# EAGLE design display (EAGLE 6.1)
APVD: B.F. (3-janv-2014); DOC_ID: CLK-SCH-01; DOC_PART_NO: CLK-PC-01; DOC_REV: A; DOC_TITLE: LED matrix display board; PROJECT_NAME: Alarm clock

## Sheet 1 of 2
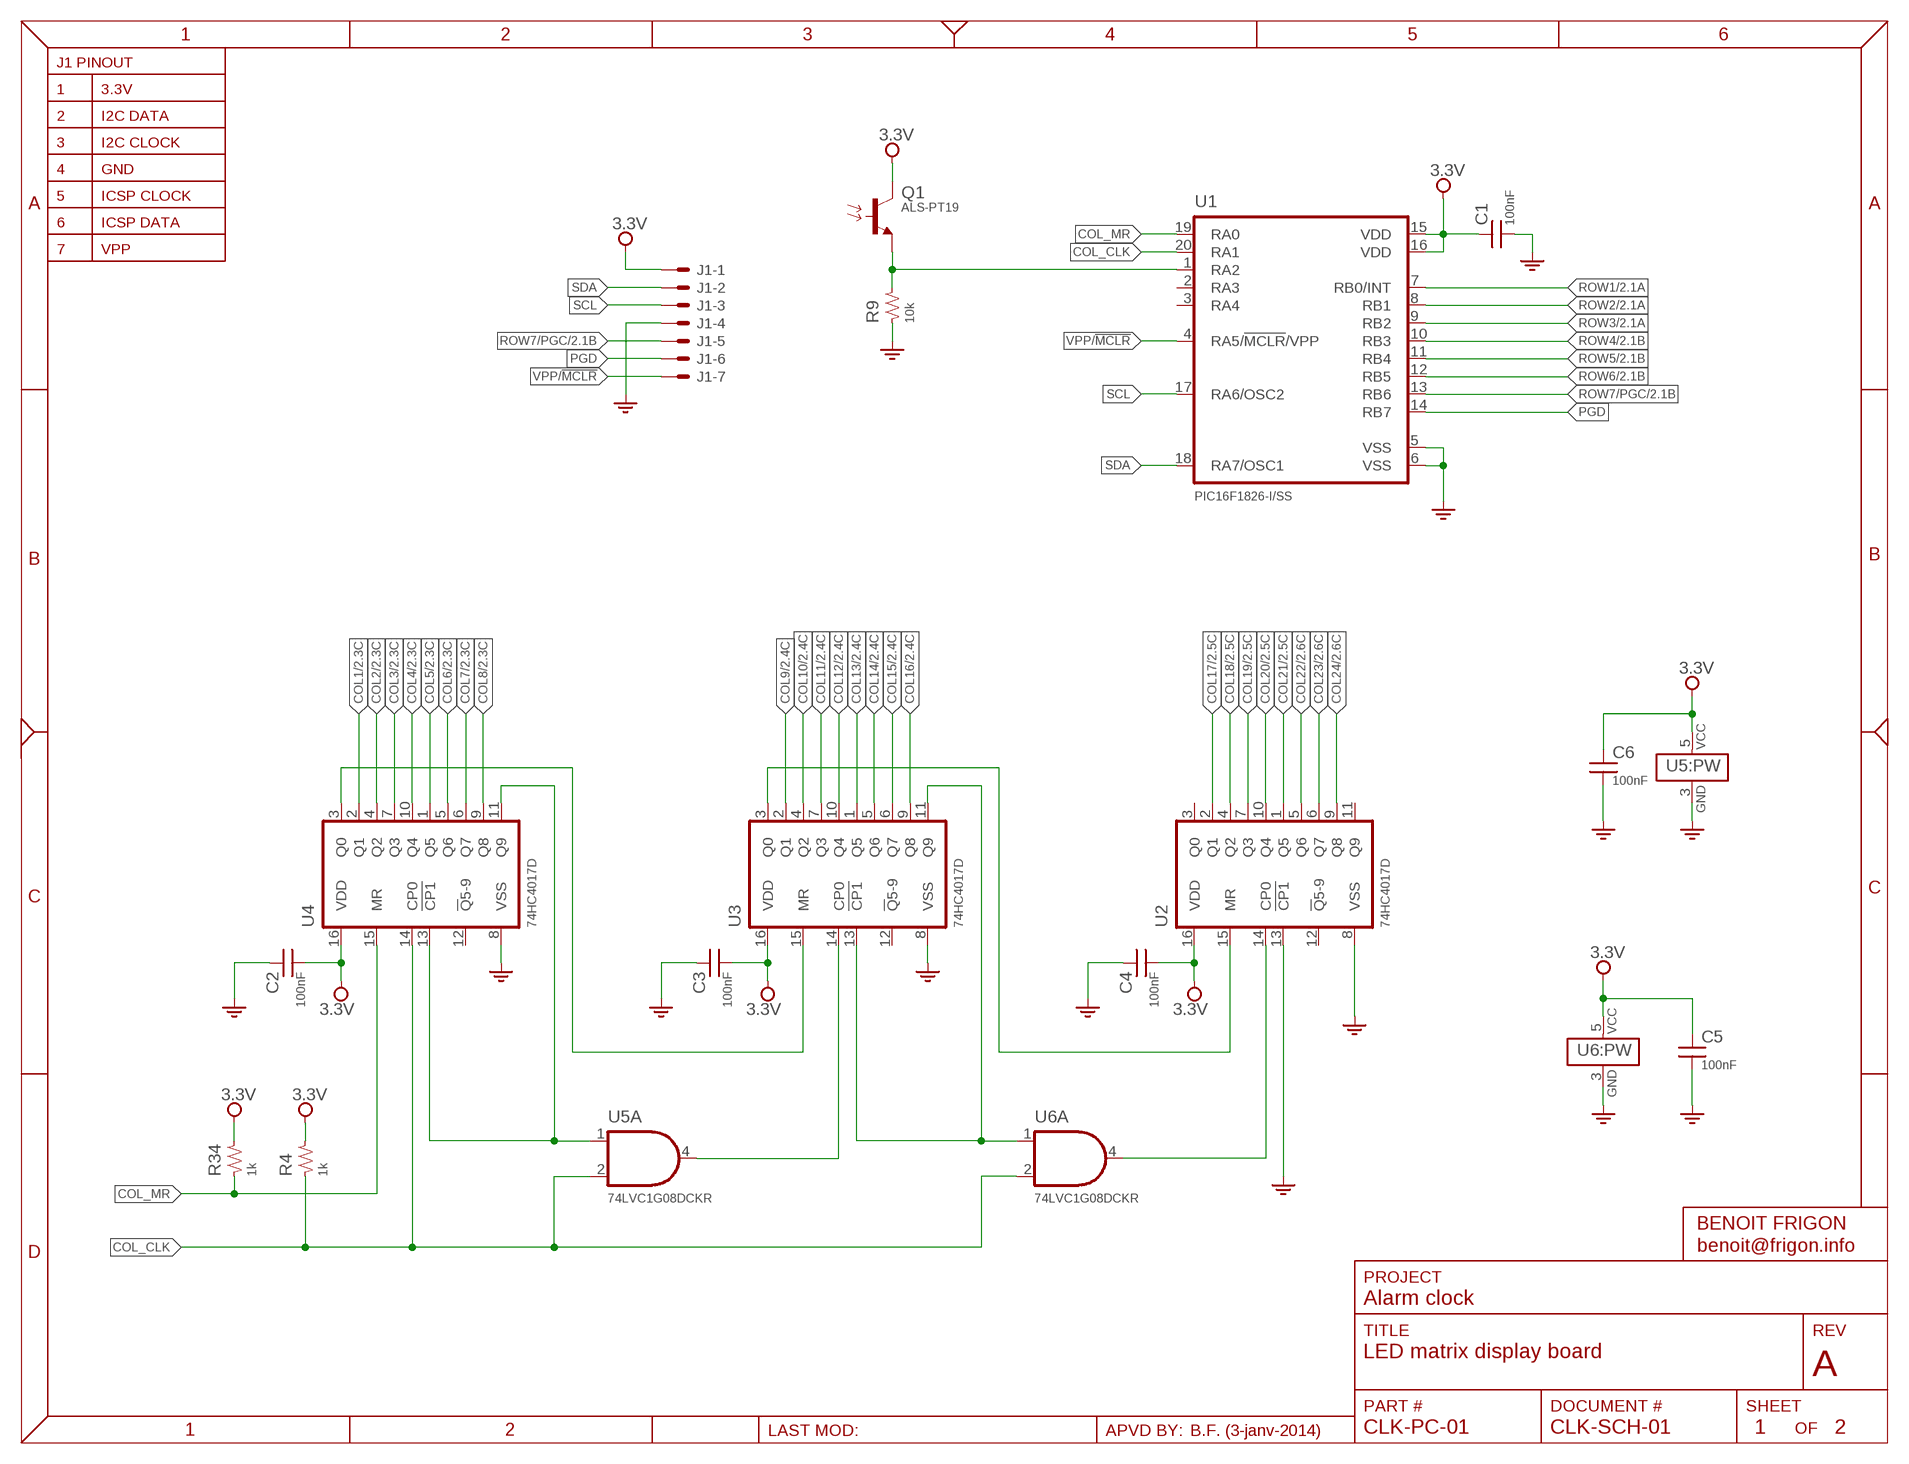
[diagram p0: schematic, sheet 1]

### Parts
C1  100nF  CAP-0603  [SMD_0603]
C2  100nF  CAP-0603  [SMD_0603]
C3  100nF  CAP-0603  [SMD_0603]
C4  100nF  CAP-0603  [SMD_0603]
C5  100nF  CAP-0603  [SMD_0603]
C6  100nF  CAP-0603  [SMD_0603]
J1  SNG-2MM-HEADER-07-V  [DF3X-7P-2DSA]
Q1  ALS-PT19  [ALS-PT19]
R4  1k  RES-0603  [SMD_0603]
R9  10k  RES-0603  [SMD_0603]
R34  1k  RES-0603  [SMD_0603]
U1  PIC16F1826-I/SS  [SSOP20]
U2  74HC4017D  [SOIC16N]
U3  74HC4017D  [SOIC16N]
U4  74HC4017D  [SOIC16N]
U5  74LVC1G08DCKR  [SC70-5]
U6  74LVC1G08DCKR  [SC70-5]

### Nets
3.3V: C1.1 C2.2 C3.2 C4.2 C5.1 C6.1 J1.1 Q1.C R4.2 R34.2 U1.15(VDD) U1.16(VDD) U2.16(VDD) U3.16(VDD) U4.16(VDD) U5.5(:PW:VCC) U6.5(:PW:VCC)
COL1: U4.2(Q1) ; also sheet 2
COL2: U4.4(Q2) ; also sheet 2
COL3: U4.7(Q3) ; also sheet 2
COL4: U4.10(Q4) ; also sheet 2
COL5: U4.1(Q5) ; also sheet 2
COL6: U4.5(Q6) ; also sheet 2
COL7: U4.6(Q7) ; also sheet 2
COL8: U4.9(Q8) ; also sheet 2
COL9: U3.2(Q1) ; also sheet 2
COL10: U3.4(Q2) ; also sheet 2
COL11: U3.7(Q3) ; also sheet 2
COL12: U3.10(Q4) ; also sheet 2
COL13: U3.1(Q5) ; also sheet 2
COL14: U3.5(Q6) ; also sheet 2
COL15: U3.6(Q7) ; also sheet 2
COL16: U3.9(Q8) ; also sheet 2
COL17: U2.2(Q1) ; also sheet 2
COL18: U2.4(Q2) ; also sheet 2
COL19: U2.7(Q3) ; also sheet 2
COL20: U2.10(Q4) ; also sheet 2
COL21: U2.1(Q5) ; also sheet 2
COL22: U2.5(Q6) ; also sheet 2
COL23: U2.6(Q7) ; also sheet 2
COL24: U2.9(Q8) ; also sheet 2
COL_CLK: R4.1 U1.20(RA1) U4.14(CP0) U5.2(A:I1) U6.2(A:I1)
COL_MR: R34.1 U1.19(RA0) U4.15(MR)
GND: C1.2 C2.1 C3.1 C4.1 C5.2 C6.2 J1.4 R9.1 U1.5(VSS) U1.6(VSS) U2.8(VSS) U2.13(!CP1) U3.8(VSS) U4.8(VSS) U5.3(:PW:GND) U6.3(:PW:GND) ; also sheet 2
N$14: Q1.E R9.2 U1.1(RA2)
N$64: U4.11(Q9) U4.13(!CP1) U5.1(A:I0)
N$65: U3.14(CP0) U5.4(A:O)
N$66: U3.15(MR) U4.3(Q0)
N$67: U2.15(MR) U3.3(Q0)
N$68: U3.11(Q9) U3.13(!CP1) U6.1(A:I0)
N$69: U2.14(CP0) U6.4(A:O)
PGD: J1.6 U1.14(RB7)
ROW1: U1.7(RB0/INT) ; also sheet 2
ROW2: U1.8(RB1) ; also sheet 2
ROW3: U1.9(RB2) ; also sheet 2
ROW4: U1.10(RB3) ; also sheet 2
ROW5: U1.11(RB4) ; also sheet 2
ROW6: U1.12(RB5) ; also sheet 2
ROW7/PGC: J1.5 U1.13(RB6) ; also sheet 2
SCL: J1.3 U1.17(RA6/OSC2)
SDA: J1.2 U1.18(RA7/OSC1)
VPP/!MCLR: J1.7 U1.4(RA5/!MCLR!/VPP)
Unconnected: U1.2(RA3) U1.3(RA4) U2.3(Q0) U2.11(Q9) U2.12(!Q!5-9) U3.12(!Q!5-9) U4.12(!Q!5-9)

## Sheet 2 of 2: LED Matrix
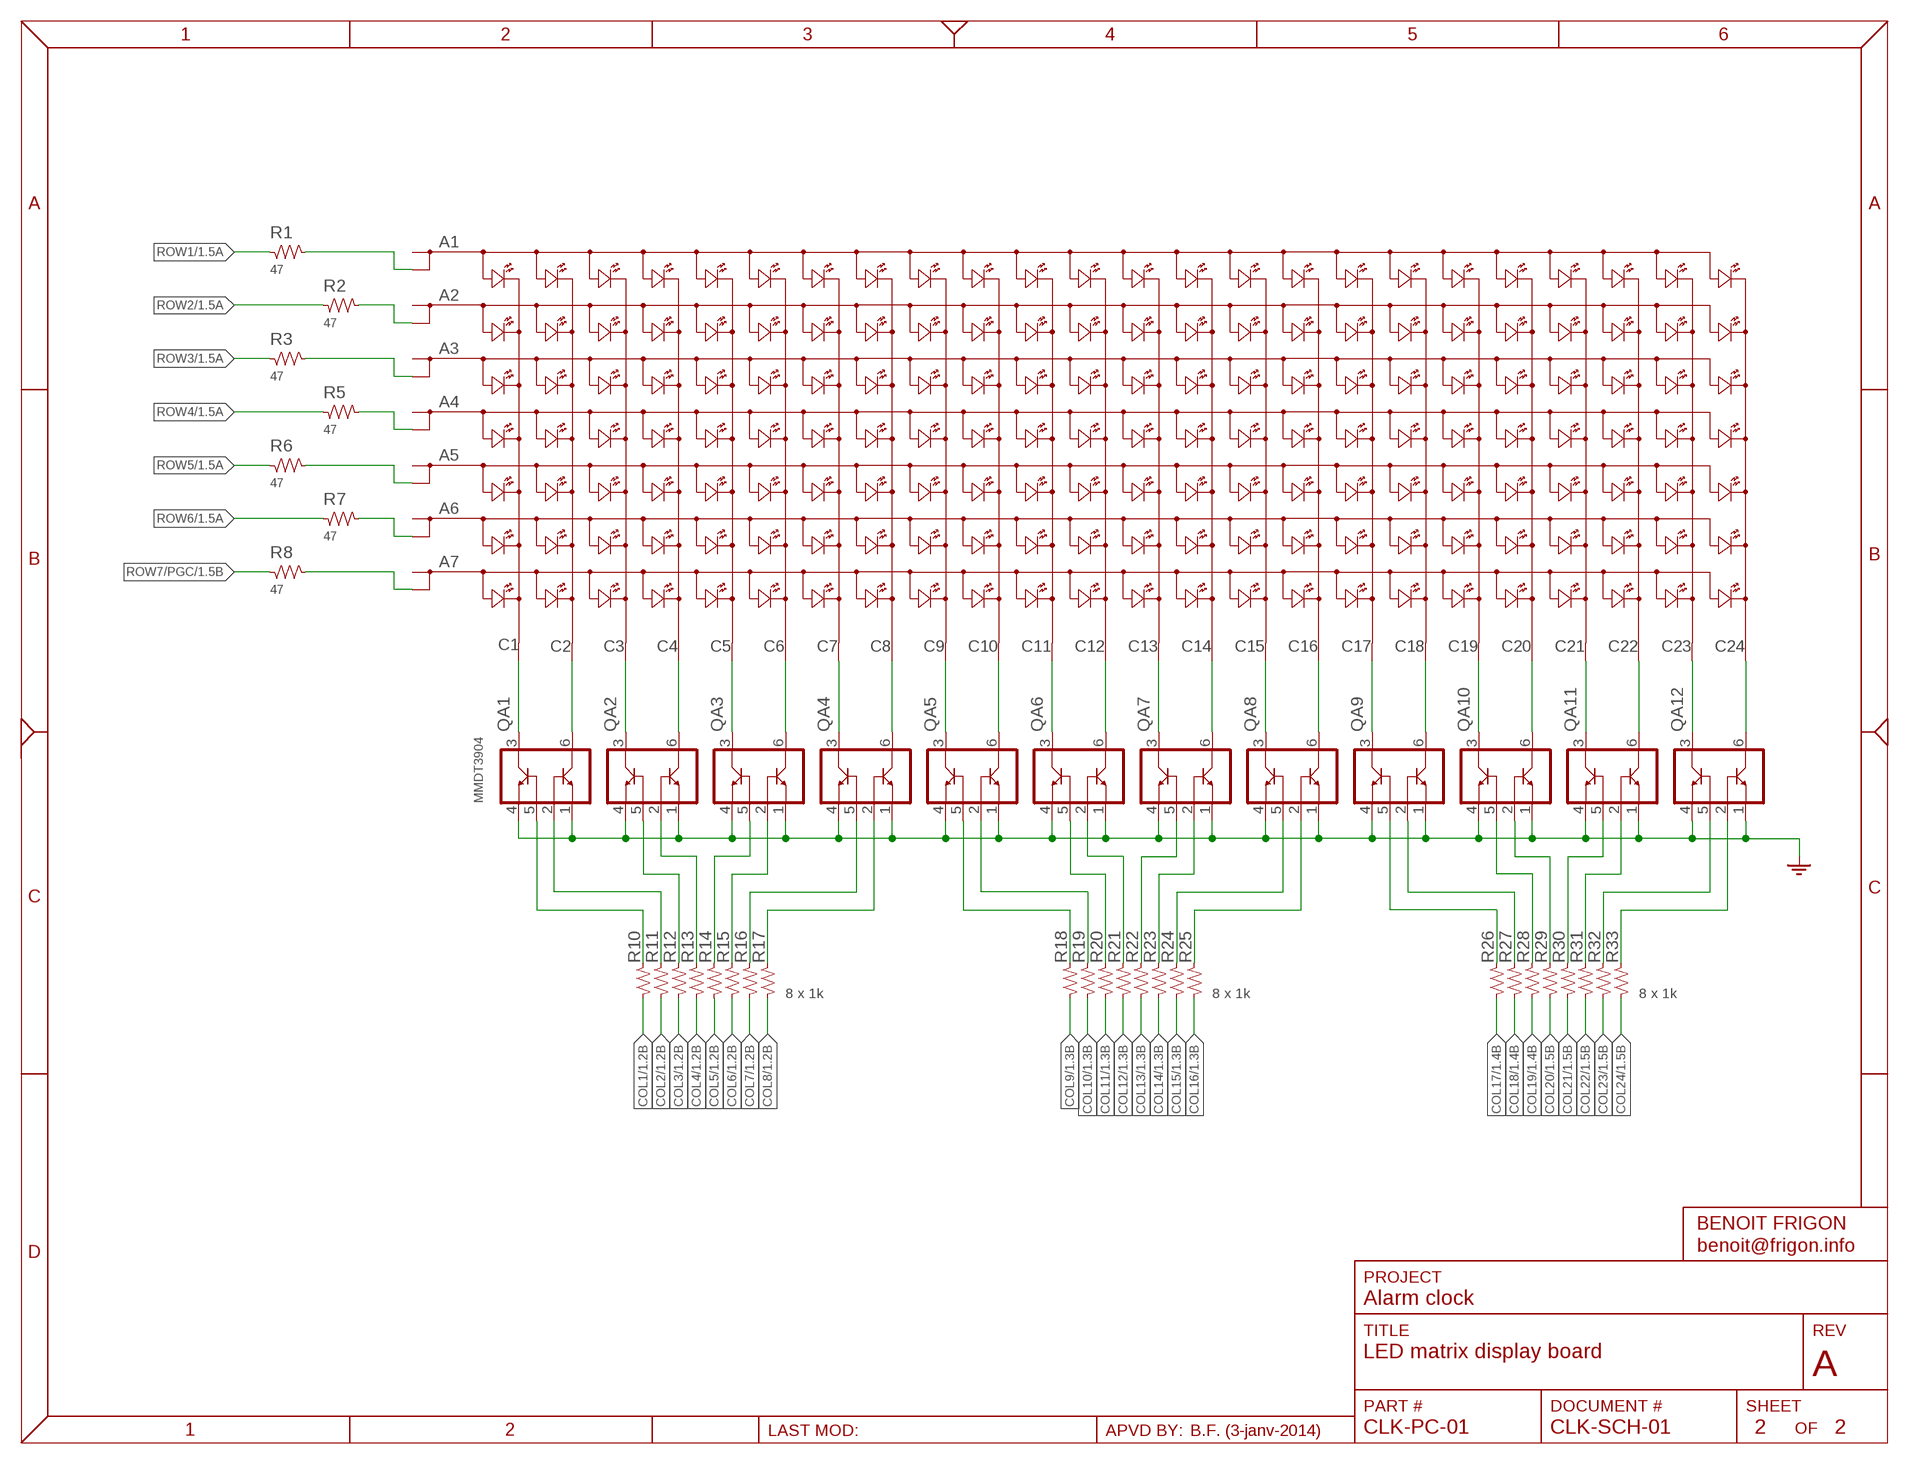
[diagram p1: schematic, sheet 2]

### Parts
QA1  MMDT3904  [SOT363]
QA2  MMDT3904  [SOT363]
QA3  MMDT3904  [SOT363]
QA4  MMDT3904  [SOT363]
QA5  MMDT3904  [SOT363]
QA6  MMDT3904  [SOT363]
QA7  MMDT3904  [SOT363]
QA8  MMDT3904  [SOT363]
QA9  MMDT3904  [SOT363]
QA10  MMDT3904  [SOT363]
QA11  MMDT3904  [SOT363]
QA12  MMDT3904  [SOT363]
R1  47  RES-0603  [SMD_0603]
R2  47  RES-0603  [SMD_0603]
R3  47  RES-0603  [SMD_0603]
R5  47  RES-0603  [SMD_0603]
R6  47  RES-0603  [SMD_0603]
R7  47  RES-0603  [SMD_0603]
R8  47  RES-0603  [SMD_0603]
R10  1k  RES-0603  [SMD_0603]
R11  1k  RES-0603  [SMD_0603]
R12  1k  RES-0603  [SMD_0603]
R13  1k  RES-0603  [SMD_0603]
R14  1k  RES-0603  [SMD_0603]
R15  1k  RES-0603  [SMD_0603]
R16  1k  RES-0603  [SMD_0603]
R17  1k  RES-0603  [SMD_0603]
R18  1k  RES-0603  [SMD_0603]
R19  1k  RES-0603  [SMD_0603]
R20  1k  RES-0603  [SMD_0603]
R21  1k  RES-0603  [SMD_0603]
R22  1k  RES-0603  [SMD_0603]
R23  1k  RES-0603  [SMD_0603]
R24  1k  RES-0603  [SMD_0603]
R25  1k  RES-0603  [SMD_0603]
R26  1k  RES-0603  [SMD_0603]
R27  1k  RES-0603  [SMD_0603]
R28  1k  RES-0603  [SMD_0603]
R29  1k  RES-0603  [SMD_0603]
R30  1k  RES-0603  [SMD_0603]
R31  1k  RES-0603  [SMD_0603]
R32  1k  RES-0603  [SMD_0603]
R33  1k  RES-0603  [SMD_0603]
U$1  LED_MATRIX_V_24X7  [LED_MATRIX_V_24X7]

### Nets
COL1: R10.1 ; also sheet 1
COL2: R11.1 ; also sheet 1
COL3: R12.1 ; also sheet 1
COL4: R13.1 ; also sheet 1
COL5: R14.1 ; also sheet 1
COL6: R15.1 ; also sheet 1
COL7: R16.1 ; also sheet 1
COL8: R17.1 ; also sheet 1
COL9: R18.1 ; also sheet 1
COL10: R19.1 ; also sheet 1
COL11: R20.1 ; also sheet 1
COL12: R21.1 ; also sheet 1
COL13: R22.1 ; also sheet 1
COL14: R23.1 ; also sheet 1
COL15: R24.1 ; also sheet 1
COL16: R25.1 ; also sheet 1
COL17: R26.1 ; also sheet 1
COL18: R27.1 ; also sheet 1
COL19: R28.1 ; also sheet 1
COL20: R29.1 ; also sheet 1
COL21: R30.1 ; also sheet 1
COL22: R31.1 ; also sheet 1
COL23: R32.1 ; also sheet 1
COL24: R33.1 ; also sheet 1
GND: QA1.1(E2) QA1.4(E1) QA2.1(E2) QA2.4(E1) QA3.1(E2) QA3.4(E1) QA4.1(E2) QA4.4(E1) QA5.1(E2) QA5.4(E1) QA6.1(E2) QA6.4(E1) QA7.1(E2) QA7.4(E1) QA8.1(E2) QA8.4(E1) QA9.1(E2) QA9.4(E1) QA10.1(E2) QA10.4(E1) QA11.1(E2) QA11.4(E1) QA12.1(E2) QA12.4(E1) ; also sheet 1
N$1: R8.2 U$1.A7@2(A7)
N$2: R7.2 U$1.A6@2(A6)
N$3: R6.2 U$1.A5@2(A5)
N$4: R5.2 U$1.A4@2(A4)
N$5: R3.2 U$1.A3@2(A3)
N$6: R2.2 U$1.A2@2(A2)
N$7: R1.2 U$1.A1@2(A1)
N$15: QA12.6(C2) U$1.C24
N$16: QA12.3(C1) U$1.C23
N$17: QA11.6(C2) U$1.C22
N$18: QA11.3(C1) U$1.C21
N$19: QA10.6(C2) U$1.C20
N$20: QA10.3(C1) U$1.C19
N$21: QA9.6(C2) U$1.C18
N$22: QA9.3(C1) U$1.C17
N$23: QA8.6(C2) U$1.C16
N$24: QA8.3(C1) U$1.C15
N$25: QA7.6(C2) U$1.C14
N$26: QA7.3(C1) U$1.C13
N$27: QA6.6(C2) U$1.C12
N$28: QA6.3(C1) U$1.C11
N$29: QA5.6(C2) U$1.C10
N$30: QA5.3(C1) U$1.C9
N$31: QA4.6(C2) U$1.C8
N$32: QA4.3(C1) U$1.C7
N$33: QA3.6(C2) U$1.C6
N$34: QA3.3(C1) U$1.C5
N$35: QA2.6(C2) U$1.C4
N$36: QA2.3(C1) U$1.C3
N$37: QA1.6(C2) U$1.C2
N$38: QA1.3(C1) U$1.C1
N$39: QA9.5(B1) R26.2
N$40: QA9.2(B2) R27.2
N$41: QA10.5(B1) R28.2
N$42: QA10.2(B2) R29.2
N$43: QA11.5(B1) R30.2
N$44: QA11.2(B2) R31.2
N$45: QA12.5(B1) R32.2
N$46: QA12.2(B2) R33.2
N$47: QA8.2(B2) R25.2
N$48: QA8.5(B1) R24.2
N$49: QA7.2(B2) R23.2
N$50: QA7.5(B1) R22.2
N$51: QA6.2(B2) R21.2
N$52: QA6.5(B1) R20.2
N$54: QA5.2(B2) R19.2
N$55: QA5.5(B1) R18.2
N$56: QA4.2(B2) R17.2
N$57: QA4.5(B1) R16.2
N$58: QA3.2(B2) R15.2
N$59: QA3.5(B1) R14.2
N$60: QA2.2(B2) R13.2
N$61: QA2.5(B1) R12.2
N$62: QA1.2(B2) R11.2
N$63: QA1.5(B1) R10.2
ROW1: R1.1 ; also sheet 1
ROW2: R2.1 ; also sheet 1
ROW3: R3.1 ; also sheet 1
ROW4: R5.1 ; also sheet 1
ROW5: R6.1 ; also sheet 1
ROW6: R7.1 ; also sheet 1
ROW7/PGC: R8.1 ; also sheet 1
Unconnected: U$1.A1@1(A1) U$1.A2@1(A2) U$1.A3@1(A3) U$1.A4@1(A4) U$1.A5@1(A5) U$1.A6@1(A6) U$1.A7@1(A7)

### Notes on the sheet
- 8 x 1k | 8 x 1k | 8 x 1k

## Library data of the parts
C1-C4 = Passive:CAP: Capacitor; DESCRIPTION: {DESCRIPTION} - SMT 0603 - {value}; PACKAGE: SMT 0603; PRICE: 0.00
C5 C6 = Passive:CAP: Capacitor; DESCRIPTION: {DESCRIPTION} - SMT 0603 - {value}; PACKAGE: SMT 0603
J1 = Connectors:SNG-2MM-HEADER-07: 2mm Single Row Header - 7 pos; DESCRIPTION: {DESCRIPTION} - SMT Vertical; MFG: Hirose Electronic; PART_NO: DF3A-7P-2DSA; PRICE: 0.37; SKU: H2099-ND; SUPPLIER: Digi-Key
Q1 = Optoelectronic:ALS-PT19: Ambiant light sensor; MFG: Everlight; PART_NO: ALS-PT19-315C/L177/TR8; PRICE: 0.70; SKU: 1080-1244-1-ND; SUPPLIER: Digi-Key
QA1-QA12 = Transistor:MMDT3904: NPN transistor - dual; MFG: Diodes Inc.; PRICE: 0.37; SKU: MMDT3904-FDICT-ND; SUPPLIER: Digi-Key
R1-R8 R10-R34 = Passive:RES: Resistor; DESCRIPTION: {DESCRIPTION} - SMT 0603 - {VALUE}; PACKAGE: SMT 0603; PRICE: 0.00
R9 = Passive:RES: Resistor; DESCRIPTION: {DESCRIPTION} - SMT 0603 - {VALUE}; PACKAGE: SMT 0603
U1 = IC:PIC16*F1826-?: 20 Pin Flash Microcontroller; MFG: Microchip; PRICE: 1.92; SKU: PIC16F1826-I/SS-ND; SUPPLIER: Digi-Key
U2-U4 = IC:74HC4017: Johnson decade counter; MFG: NXP Semiconductors; PART_NO: 74HC4017D,653; PRICE: 0.77; SKU: 568-8146-1-ND; SUPPLIER: Digi-Key
U5 U6 = Logic:74*1G08: 2-input AND gate; MFG: Texas Instruments; PRICE: 0.29; SKU: 296-11602-1-ND; SUPPLIER: Digi-Key
U$1 = Misc:LED_MATRIX_V_24X7; BOM: NO

## Board
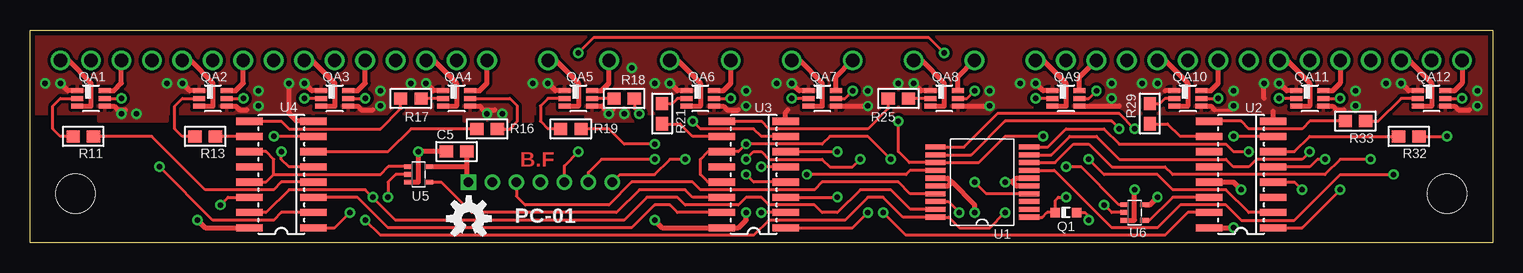
[diagram p2: board, top side]
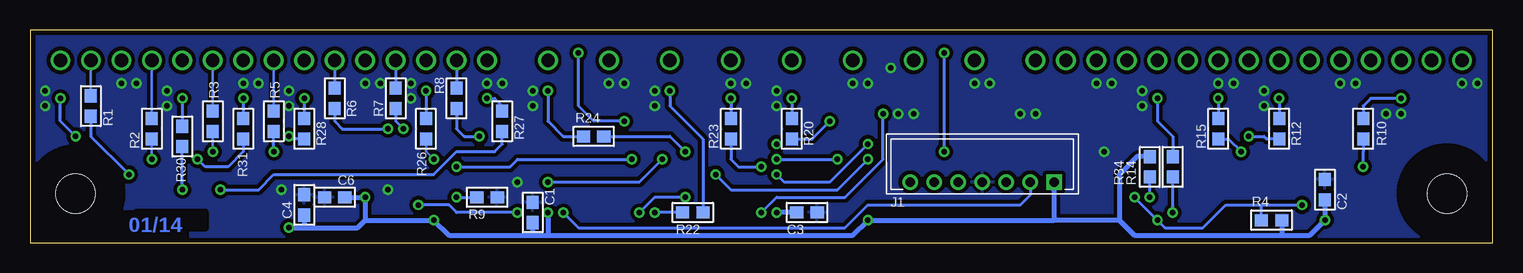
[diagram p3: board, bottom side, seen from below]

Size 121.92 x 17.78 mm. Coordinates in mm from the lower left corner, seen from the top.
Outline: 0,0 0,17.78 121.92,17.78 121.92,0 0,0
Copper layers (1*16): Top 0.035mm / dielectric 1.5mm / Bottom 0.035mm
Design rules: minimum track width 8mil, minimum drill 18mil, track to track 8mil, track to pad 8mil, pad to pad 8mil, via to via 8mil, smd to smd 8mil, copper to edge 16mil, drill to drill 8mil, minimum pad ring 10mil, minimum via ring 8mil, stop-mask expansion 4mil, vias tented up to drill 24mil, thermal gap 10mil
Holes 3.28 mm at 3.81,4.11 118.11,4.11
bKeepout: area 30.5,0 to 54.6,13.3
tRestrict: area 0,0.3 to 7.6,7.9; area 114.3,0.3 to 121.9,7.9
bRestrict: area 114.3,0.3 to 121.9,7.9; area -0.1,0.3 to 7.7,8; area 107.3,1.3 to 113,2.5

### Footprints (pad centres in the part's own frame; a part is rotated, then mirrored left to right if it is on the bottom)
SMD_0603 = smd 1.1 x 1: 1 -0.85,0; 2 0.85,0
DF3X-7P-2DSA = drill 0.8 square: 1 6,0 | drill 0.8: 2 4,0; 3 2,0; 4 0,0; 5 -2,0; 6 -4,0; 7 -6,0
ALS-PT19 = smd 0.8 x 0.8: C -0.9,0; E 0.9,0
SOT363 = smd 0.42 x 1: 1 -0.65,-1.137; 2 0,-1.137; 3 0.65,-1.137; 4 0.65,1.137; 5 0,1.137; 6 -0.65,1.137
SSOP20 = smd 0.42 x 1.7: 1 -2.925,-3.9; 2 -2.275,-3.9; 3 -1.625,-3.9; 4 -0.975,-3.9; 5 -0.325,-3.9; 6 0.325,-3.9; 7 0.975,-3.9; 8 1.625,-3.9; 9 2.275,-3.9; 10 2.925,-3.9; 11 2.925,3.9; 12 2.275,3.9; 13 1.625,3.9; 14 0.975,3.9; 15 0.325,3.9; 16 -0.325,3.9; 17 -0.975,3.9; 18 -1.625,3.9; 19 -2.275,3.9; 20 -2.925,3.9
SOIC16N = smd 0.6 x 2.2: 1 -4.445,-2.667; 2 -3.175,-2.667; 3 -1.905,-2.667; 4 -0.635,-2.667; 5 0.635,-2.667; 6 1.905,-2.667; 7 3.175,-2.667; 8 4.445,-2.667; 9 4.445,2.667; 10 3.175,2.667; 11 1.905,2.667; 12 0.635,2.667; 13 -0.635,2.667; 14 -1.905,2.667; 15 -3.175,2.667; 16 -4.445,2.667
SC70-5 = smd 0.4 x 0.7: 1 -0.65,-0.85; 2 0,-0.85; 3 0.65,-0.85; 4 0.65,0.85; 5 -0.65,0.85
LED_MATRIX_V_24X7 = drill 1.1: A1@1 2.54,0; A1@2 114.3,0; A2@1 7.62,0; A2@2 109.22,0; A3@1 12.7,0; A3@2 104.14,0; A4@1 17.78,0; A4@2 99.06,0; A5@1 22.86,0; A5@2 93.98,0; A6@1 27.94,0; A6@2 88.9,0; A7@1 33.02,0; A7@2 83.82,0; C1 0,0; C2 5.08,0; C3 10.16,0; C4 15.24,0; C5 20.32,0; C6 25.4,0; C7 30.48,0; C8 35.56,0; C9 40.64,0; C10 45.72,0; C11 50.8,0; C12 55.88,0; C13 60.96,0; C14 66.04,0; C15 71.12,0; C16 76.2,0; C17 81.28,0; C18 86.36,0; C19 91.44,0; C20 96.52,0; C21 101.6,0; C22 106.68,0; C23 111.76,0; C24 116.84,0

### Placement (x,y rotation side)
C1  80.01,2.54 90 bottom
C2  13.97,4.45 270 bottom
C3  57.15,2.54 180 bottom
C4  99.06,3.17 270 bottom
C5  35.56,7.62 180 top
C6  96.52,3.81 180 bottom
J1  42.55,5.08 0 bottom
Q1  86.36,2.54 180 top
QA1  5.08,12.06 270 top
QA2  15.24,12.06 270 top
QA3  25.4,12.06 270 top
QA4  35.56,12.06 270 top
QA5  45.72,12.06 270 top
QA6  55.88,12.06 270 top
QA7  66.04,12.06 270 top
QA8  76.2,12.06 270 top
QA9  86.36,12.06 270 top
QA10  96.52,12.06 270 top
QA11  106.68,12.06 270 top
QA12  116.84,12.06 270 top
R1  116.84,11.43 90 bottom
R2  111.76,9.53 90 bottom
R3  106.68,10.16 90 bottom
R4  18.41,1.91 0 bottom
R5  101.6,10.16 90 bottom
R6  96.52,12.06 90 bottom
R7  91.44,12.06 90 bottom
R8  86.36,12.06 90 bottom
R9  83.82,3.81 180 bottom
R10  10.79,9.53 90 bottom
R11  4.45,8.89 180 top
R12  17.78,9.53 90 bottom
R13  14.61,8.89 180 top
R14  26.67,6.35 90 bottom
R15  22.86,9.53 90 bottom
R16  38.1,9.53 0 top
R17  31.75,12.06 0 top
R18  49.53,12.06 180 top
R19  45.09,9.53 180 top
R20  58.42,9.53 90 bottom
R21  52.7,10.79 90 top
R22  66.67,2.54 0 bottom
R23  63.5,9.53 90 bottom
R24  74.93,8.89 180 bottom
R25  72.39,12.06 0 top
R26  88.9,9.53 90 bottom
R27  82.55,10.16 90 bottom
R28  99.06,9.53 90 bottom
R29  93.34,10.79 90 top
R30  109.22,8.89 90 bottom
R31  104.14,9.53 90 bottom
R32  114.94,8.89 0 top
R33  110.49,10.16 0 top
R34  28.57,6.35 90 bottom
U1  79.38,5.08 90 top
U2  100.97,5.71 90 top
U3  60.33,5.71 90 top
U4  20.95,5.71 90 top
U5  32.38,5.71 270 top
U6  92.08,2.54 270 top
U$1  2.54,15.24 0 top
U$3  [OPENHW_LOGO_150]  36.58,2.03 0 top
U$6  [INFO_DATE]  109.22,2.16 180 bottom
U$7  [INFO_AUTHOR]  42.29,6.99 0 top

### Tracks (layer width: path | path; a pad name or v marks a point on that pad's centre or on a via)
3.3V  (via drill 0.46)
  Top 0.254: Q1.C 87.95,2.54 88.27,2.22 v88.27,1.91
  Top 0.406: U2.16 v100.33,1.27 | v52.07,1.91 52.7,1.27 U3.16 59.05,1.27 59.69,1.91 v59.69,2.54 | v13.97,1.91 14.61,1.27 U4.16 | U1.16 76.51,4.75 76.83,5.08 | U1.15 76.51,5.41 76.83,5.08 | 76.83,5.08 78.74,3.17 v78.74,2.54 | U6.5 93.36,3.19 v93.98,3.81 | U5.5 36.41,6.37 | C5.1 36.41,6.37 | 36.41,6.37 36.41,5.08 J1.1
  Bottom 0.406: v100.33,1.27 99.06,1.27 | 99.06,1.27 94.61,1.27 93.98,1.91 | 93.98,1.91 v88.27,1.91 87,0.64 80.01,0.64 | v78.74,2.54 78.74,0.64 | 78.74,0.64 53.34,0.64 v52.07,1.91 36.55,1.91 | 31.11,1.91 29.84,0.64 17.57,0.64 | 17.57,0.64 15.24,0.64 v13.97,1.91 C2.2 | 93.98,1.91 v93.98,3.81 C6.1 | 80.01,0.64 78.74,0.64 | C1.1 80.01,0.64 | C4.2 99.06,1.27 | 31.11,1.91 36.55,1.91 | 36.55,1.91 J1.1 | R4.2 17.57,0.64 | C3.2 v59.69,2.54 | R34.2 29.63,7.2 31.11,5.71 31.11,1.91
COL1  (via drill 0.46)
  Top 0.254: U4.2 20.95,2.54 20.32,1.91 15.24,1.91 v10.79,6.35
  Bottom 0.254: v10.79,6.35 10.79,7.62 R10.1
COL2
  Top 0.254: U4.4 20.95,5.08 20.32,4.45 14.61,4.45 10.16,8.89 R11.1
COL3  (via drill 0.46)
  Top 0.254: U4.7 v20.32,8.89
  Bottom 0.254: v20.32,8.89 19.05,8.89 18.84,8.68 R12.1
COL4
  Top 0.254: U4.10 R13.1
COL5  (via drill 0.46)
  Top 0.254: U4.1 25.4,1.27 v26.67,2.54
  Bottom 0.254: v26.67,2.54 R14.1
COL6  (via drill 0.46)
  Top 0.254: U4.5 21.59,6.35 20.95,6.99 v20.95,7.62
  Bottom 0.254: R15.1 22.01,8.68 v20.95,7.62
COL7
  Top 0.254: U4.6 29.84,7.62 31.75,9.53 R16.1
COL8
  Top 0.254: U4.9 20.95,10.16 21.59,9.53 29.21,9.53 30.9,11.21 R17.1
COL9  (via drill 0.46)
  Top 0.254: U3.2 v60.96,2.54 | R18.1 50.38,11.21 v50.8,10.79
  Bottom 0.254: v60.96,2.54 59.69,3.81 53.98,3.81 50.8,6.99 v50.8,10.79
COL10  (via drill 0.46)
  Top 0.254: U3.4 60.33,5.08 v59.69,5.71 | v52.07,8.26 49.53,8.26 48.26,9.53 R19.1
  Bottom 0.254: v59.69,5.71 59.05,5.08 55.24,5.08 v52.07,8.26
COL11  (via drill 0.46)
  Top 0.254: U3.7 60.96,8.89 60.33,9.53 55.88,9.53 v55.24,10.16
  Bottom 0.254: R20.1 56.73,8.68 v55.24,10.16
COL12
  Top 0.254: U3.10 55.24,8.89 54.19,9.95 R21.1
COL13  (via drill 0.46)
  Top 0.254: U3.1 68.58,1.27 v69.85,2.54
  Bottom 0.254: R22.1 v69.85,2.54
COL14  (via drill 0.46)
  Top 0.254: U3.5 v60.96,6.35
  Bottom 0.254: R23.1 63.5,6.99 62.87,6.35 v60.96,6.35
COL15  (via drill 0.46)
  Top 0.254: U3.6 v67.31,7.62
  Bottom 0.254: v67.31,7.62 68.58,8.89 R24.1
COL16
  Top 0.254: R25.1 71.54,11.21 69.85,9.53 61.59,9.53 60.96,10.16 U3.9
COL17  (via drill 0.46)
  Top 0.254: U2.2 101.6,2.54 99.69,4.45 95.25,4.45 93.98,5.71 89.53,5.71 v88.27,6.99
  Bottom 0.203: v88.27,6.99 88.9,7.62 R26.1
COL18  (via drill 0.46)
  Top 0.254: U2.4 105.41,5.08 v106.05,4.45
  Bottom 0.254: v106.05,4.45 102.87,4.45 101.6,5.71 88.27,5.71 86.36,7.62 83.19,7.62 82.55,8.26 R27.1
COL19  (via drill 0.46)
  Top 0.254: U2.7 v100.33,8.89
  Bottom 0.203: 99.06,8.89 R28.1
  Bottom 0.254: R28.1 100.11,8.68 v100.33,8.89
COL20
  Top 0.254: U2.10 95.89,8.89 94.83,9.95 R29.1
COL21  (via drill 0.46)
  Top 0.254: U2.1 106.05,1.27 v109.22,4.45
  Bottom 0.254: v109.22,4.45 R30.1
COL22  (via drill 0.46)
  Top 0.254: v107.95,6.99 107.31,6.99 106.68,6.35 U2.5 103.5,6.35
  Bottom 0.254: R31.1 104.14,7.62 105.41,6.35 107.31,6.35 v107.95,6.99
COL23
  Top 0.254: U2.6 105.41,7.62 106.68,8.89 R32.1
COL24
  Top 0.254: R33.1 106.68,10.16 106.05,9.53 101.6,9.53 100.97,10.16 U2.9
COL_CLK  (via drill 0.46)
  Top 0.254: U6.2 90.17,2.54 v89.53,3.17 | v27.94,1.91 29.21,0.64 60.33,0.64 61.59,1.91 67.94,1.91 69.85,3.81 71.12,3.81 72.78,2.15 U1.20 76.58,2.15 77.47,1.27 80.01,1.27 v81.28,2.54 | v15.88,3.17 16.51,3.81 U4.14 | v29.84,3.81 29.84,5.08 30.48,5.71 U5.2
  Bottom 0.254: 19.27,3.17 22.23,3.17 24.13,1.27 27.3,1.27 v27.94,1.91 v29.84,3.81 | 19.27,3.17 v15.88,3.17 | R4.1 19.27,3.17 | v81.28,2.54 86.36,2.54 87,3.17 v89.53,3.17
COL_MR  (via drill 0.46)
  Top 0.254: U1.19 73.39,2.81 71.75,4.45 69.22,4.45 67.31,2.54 66.04,2.54 65.41,3.17 61.59,3.17 60.96,3.81 59.69,3.81 59.05,3.17 54.61,3.17 53.98,3.81 51.44,3.81 49.53,1.91 30.48,1.91 v28.57,3.81 27.94,4.45 21.59,4.45 19.68,2.54 U4.15
  Bottom 0.254: v28.57,3.81 R34.1
GND  (via drill 0.46)
  Top 0.254: 94.63,12.71 94.61,12.7 | 98.74,11.11 100.33,11.11 v100.33,11.43
  Top 0.406: U2.13 100.33,5.08 v100.97,4.45 | QA10.1 94.63,12.71 | QA10.4 98.44,11.41 98.74,11.11 | QA9.4 90.79,11.41 90.81,11.43 | QA7.4 69.83,11.41 v69.85,11.43 | QA8.4 80,11.41 v80.01,11.43 | QA6.4 57.8,11.41 58.1,11.11 59.05,11.11 | QA7.1 64.12,12.71 v63.5,13.34 | QA8.1 74.28,12.71 v73.66,13.34 | QA12.1 114.92,12.71 v114.3,13.34 | QA11.1 104.76,12.71 v104.14,13.34 | QA9.1 84.44,12.71 v83.82,13.34 | QA1.4 7,11.41 7.3,11.11 7.94,11.11 | QA2.4 17.16,11.41 17.46,11.11 18.1,11.11 | QA3.4 27.32,11.41 27.62,11.11 28.57,11.11 | QA4.4 37.48,11.41 37.78,11.11 38.73,11.11 | QA5.4 47.64,11.41 47.94,11.11 48.58,11.11 | QA11.4 108.6,11.41 108.9,11.11 109.54,11.11 | QA12.4 118.76,11.41 119.06,11.11 120.02,11.11 | QA6.1 53.96,12.71 v53.34,13.34 | QA5.1 43.8,12.71 v43.18,13.34 | QA4.1 33.64,12.71 v33.02,13.34 | QA3.1 23.48,12.71 v22.86,13.34 | QA2.1 13.32,12.71 v12.7,13.34 | QA1.1 3.16,12.71 v2.54,13.34 | U4.8 22.23,10.16 21.59,10.79 v21.59,13.34 | U3.8 62.99,10.92 63.18,11.11 | U6.3 92.08,1.89 v92.08,4.45 | C5.2 v32.38,7.62 32.38,5.07 U5.3 | U2.8 103.63,10.99 | 102.87,12.06 v102.87,13.34 | U1.5 82.24,4.75 81.92,5.08 | 81.92,5.08 v81.28,5.08 | U1.6 82.24,5.41 81.92,5.08
  other vias: 11.43,13.34 1.27,13.34 19.05,12.7 41.91,13.34 29.21,11.43 31.75,13.34 38.1,10.79 48.26,10.79 50.16,14.61 52.07,13.34 62.23,13.34 59.69,12.7 69.85,12.7 72.39,13.34 80.01,12.7 82.55,13.34 93.98,13.34 92.71,13.34 90.17,12.06 90.17,13.34 100.33,12.7 7.62,10.79 110.49,11.43 110.49,12.7 113.03,13.34 120.65,11.43 120.65,12.7 49.53,10.79 39.37,10.79 8.89,10.79 19.05,11.43 29.21,12.7 59.69,11.43
  pour Bottom (isolate 0.305): 0,17.78 121.92,17.78 121.92,0 0,0
  pour Top (isolate 0.254): 0,17.78 121.92,17.78 121.92,10.79 50.8,10.79 50.8,10.16 46.35,10.16 46.35,10.79 41.91,10.79 41.91,10.16 36.2,10.16 36.2,10.79 11.43,10.79 11.43,10.16 5.71,10.16 5.71,10.79 0,10.79
N$1
  Bottom 0.254: U$1.A7@2 R8.2
N$2
  Bottom 0.254: U$1.A6@2 R7.2
N$3
  Bottom 0.254: U$1.A5@2 R6.2
N$4
  Bottom 0.203: U$1.A4@2 R5.2
N$5
  Bottom 0.203: U$1.A3@2 R3.2
N$6
  Bottom 0.203: U$1.A2@2 R2.2
N$7
  Bottom 0.203: U$1.A1@2 116.84,13.97 R1.2
N$14  (via drill 0.46)
  Top 0.254: U1.1 84.39,2.15 84.77,2.54 Q1.E 85.46,3.54 85.72,3.81 v86.36,3.81
  Bottom 0.254: v86.36,3.81 R9.2
N$15
  Top 0.406: QA12.6 118.76,12.71 119.38,13.34 U$1.C24
N$16
  Top 0.406: U$1.C23 114.94,15.24 116.84,13.34 116.84,11.41 QA12.3
N$17
  Top 0.406: QA11.6 108.6,12.71 109.22,13.34 U$1.C22
N$18
  Top 0.406: U$1.C21 104.78,15.24 106.68,13.34 106.68,11.41 QA11.3
N$19
  Top 0.406: QA10.6 98.44,12.71 99.06,13.34 U$1.C20
N$20
  Top 0.406: U$1.C19 94.61,15.24 96.52,13.34 96.52,11.41 QA10.3
N$21
  Top 0.406: QA9.6 87.5,13.84 U$1.C18
N$22
  Top 0.406: U$1.C17 84.45,15.24 86.36,13.34 86.36,11.41 QA9.3
N$23
  Top 0.406: QA8.6 77.34,13.84 U$1.C16
N$24
  Top 0.406: U$1.C15 74.3,15.24 76.2,13.34 76.2,11.41 QA8.3
N$25
  Top 0.406: QA7.6 67.18,13.84 U$1.C14
N$26
  Top 0.406: U$1.C13 64.14,15.24 66.04,13.34 66.04,11.41 QA7.3
N$27
  Top 0.406: QA6.6 57.8,12.71 58.42,13.34 U$1.C12
N$28
  Top 0.406: U$1.C11 53.98,15.24 55.88,13.34 55.88,11.41 QA6.3
N$29
  Top 0.406: QA5.6 47.64,12.71 48.26,13.34 U$1.C10
N$30
  Top 0.406: U$1.C9 43.81,15.24 45.72,13.34 45.72,11.41 QA5.3
N$31
  Top 0.406: QA4.6 37.48,12.71 38.1,13.34 U$1.C8
N$32
  Top 0.406: U$1.C7 33.66,15.24 35.56,13.34 35.56,11.41 QA4.3
N$33
  Top 0.406: QA3.6 27.32,12.71 27.94,13.34 U$1.C6
N$34
  Top 0.406: U$1.C5 23.5,15.24 25.4,13.34 25.4,11.41 QA3.3
N$35
  Top 0.406: QA2.6 17.16,12.71 17.78,13.34 U$1.C4
N$36
  Top 0.406: U$1.C3 13.34,15.24 15.24,13.34 15.24,11.41 QA2.3
N$37
  Top 0.406: QA1.6 7,12.71 7.62,13.34 U$1.C2
N$38
  Top 0.406: U$1.C1 3.17,15.24 5.08,13.34 5.08,11.41 QA1.3
N$39  (via drill 0.46)
  Top 0.254: QA9.5 88.27,12.06 v88.9,12.7
  Bottom 0.254: v88.9,12.7 R26.2
N$40  (via drill 0.46)
  Top 0.254: QA9.2 v83.82,12.06
  Bottom 0.254: v83.82,12.06 83.19,12.06 82.55,11.43 R27.2
N$41  (via drill 0.46)
  Top 0.254: QA10.5 v99.06,12.06
  Bottom 0.254: v99.06,12.06 R28.2
N$42
  Top 0.254: R29.2 94.19,11.64 94.61,12.06 QA10.2
N$43  (via drill 0.46)
  Top 0.254: QA11.5 v109.22,12.06
  Bottom 0.254: v109.22,12.06 R30.2
N$44  (via drill 0.46)
  Top 0.254: QA11.2 v104.14,12.06
  Bottom 0.254: v104.14,12.06 R31.2
N$45  (via drill 0.46)
  Top 0.254: QA12.5 v119.38,12.06 | R32.2 v118.11,8.89
  Bottom 0.254: v118.11,8.89 119.38,10.16 v119.38,12.06
N$46
  Top 0.254: R33.2 112.39,10.16 114.3,12.06 QA12.2
N$47
  Top 0.254: QA8.2 R25.2 | R25.2 73.03,12.06 73.24,12.28 R25.2
N$48  (via drill 0.46)
  Top 0.254: QA8.5 78.11,12.06 v78.74,12.7
  Bottom 0.254: v78.74,12.7 78.74,10.16 77.47,8.89 R24.2
N$49  (via drill 0.46)
  Top 0.254: QA7.2 v63.5,12.06
  Bottom 0.254: v63.5,12.06 R23.2
N$50  (via drill 0.46)
  Top 0.254: QA7.5 67.94,12.06 v68.58,12.7
  Bottom 0.254: v68.58,12.7 68.58,11.43 65.83,8.68 R22.2
N$51
  Top 0.254: R21.2 53.55,11.64 53.98,12.06 QA6.2
N$52  (via drill 0.46)
  Top 0.254: QA6.5 v58.42,12.06
  Bottom 0.254: v58.42,12.06 R20.2
N$54
  Top 0.254: QA5.2 43.18,12.06 42.55,11.43 42.55,10.16 43.18,9.53 R19.2
N$55
  Top 0.254: R18.2 QA5.5
N$56
  Top 0.254: QA4.2 33.02,12.06 R17.2
N$57
  Top 0.254: QA4.5 40.01,12.06 40.64,11.43 40.64,10.16 40.01,9.53 R16.2
N$58  (via drill 0.46)
  Top 0.254: QA3.2 v22.86,12.06
  Bottom 0.254: v22.86,12.06 R15.2
N$59  (via drill 0.46)
  Top 0.254: QA3.5 v27.94,12.06
  Bottom 0.254: v27.94,12.06 27.94,10.16 26.67,8.89 R14.2
N$60
  Top 0.254: R13.2 12.7,8.89 12.06,9.53 12.06,11.43 12.7,12.06 QA2.2
N$61  (via drill 0.46)
  Top 0.254: QA2.5 v17.78,12.06
  Bottom 0.254: v17.78,12.06 R12.2
N$62
  Top 0.254: R11.2 2.54,8.89 1.91,9.53 1.91,11.43 2.54,12.06 QA1.2
N$63  (via drill 0.46)
  Top 0.254: QA1.5 v7.62,12.06
  Bottom 0.254: v7.62,12.06 10.16,12.06 10.79,11.43 R10.2
N$64
  Top 0.254: U4.13 19.68,5.08 20.32,5.71 | 20.32,5.71 20.32,6.99 19.68,7.62 U4.11 | 20.32,5.71 29.21,5.71 29.86,6.37 U5.1
N$65
  Top 0.254: U3.14 55.24,3.81 54.61,4.45 50.8,4.45 48.9,2.54 36.83,2.54 34.3,5.07 U5.4
N$66
  Top 0.254: U3.15 53.98,2.54 53.34,3.17 52.07,3.17 50.16,1.27 29.84,1.27 27.3,3.81 U4.3
N$67  (via drill 0.46)
  Top 0.254: U2.15 96.52,2.54 94.61,0.64 73.03,0.64 v71.12,2.54 | U3.3 v67.31,3.81
  Bottom 0.254: v67.31,3.81 69.85,3.81 v71.12,2.54
N$68  (via drill 0.46)
  Top 0.254: v86.36,6.35 87.63,6.35 90.79,3.19 U6.1 | v71.75,6.99 69.85,8.89 66.67,8.89 66.04,8.26 v59.69,8.26 59.05,7.62 U3.11 56.52,7.62 55.88,6.99 55.88,5.71 56.52,5.08 U3.13
  Bottom 0.254: v86.36,6.35 81.92,6.35 81.28,6.99 v71.75,6.99
N$69
  Top 0.254: U6.4 93.33,1.89 95.25,3.81 U2.14
PGD  (via drill 0.46)
  Top 0.254: U1.14 73.36,6.05 73.03,5.71 v64.77,5.71 | v52.07,6.99 47.62,6.99 46.55,5.91 J1.6
  Bottom 0.254: v64.77,5.71 63.5,4.45 54.61,4.45 v52.07,6.99
ROW1  (via drill 0.46)
  Top 0.254: U1.7 85.39,6.05 90.17,1.27 93.98,1.27 95.89,3.17 99.69,3.17 100.97,1.91 105.41,1.91 109.22,5.71 v113.67,5.71
  Bottom 0.254: R1.1 116.84,8.89 v113.67,5.71
ROW2  (via drill 0.46)
  Top 0.254: v111.76,6.99 109.22,6.99 107.95,5.71 95.25,5.71 94.61,6.35 90.17,6.35 88.27,8.26 87,8.26 85.44,6.71 U1.8
  Bottom 0.203: R2.1 v111.76,6.99
ROW3  (via drill 0.46)
  Top 0.254: v106.68,7.62 106.05,6.99 102.23,6.99 101.6,6.35 100.33,6.35 99.69,6.99 90.81,6.99 88.9,8.89 86.68,8.89 85.14,7.36 U1.9
  Bottom 0.203: R3.1 v106.68,7.62
ROW4  (via drill 0.46)
  Top 0.254: U1.10 84.84,8.01 86.36,9.53 89.53,9.53 90.81,8.26 99.69,8.26 100.33,7.62 v101.6,7.62
  Bottom 0.254: v101.6,7.62 R5.1
ROW5  (via drill 0.46)
  Top 0.254: v92.08,9.53 90.81,10.79 80.64,10.79 77.86,8.01 U1.11
  Bottom 0.254: R6.1 96.52,10.16 95.89,9.53 v92.08,9.53
ROW6  (via drill 0.46)
  Top 0.254: v90.81,9.53 90.17,10.16 81.28,10.16 78.47,7.36 U1.12
  Bottom 0.254: R7.1 91.44,10.16 v90.81,9.53
ROW7/PGC  (via drill 0.46)
  Top 0.254: v84.45,8.89 81.28,8.89 79.09,6.71 U1.13 73.31,6.71 72.39,7.62 v72.39,10.16 | J1.5 44.55,6.45 v45.72,7.62 | v76.2,15.88 74.93,17.14 46.99,17.14 v45.72,15.88
  Bottom 0.254: R8.1 86.36,9.53 85.72,8.89 v84.45,8.89 | v72.39,10.16 74.93,10.16 76.2,11.43 v76.2,15.88 | v45.72,15.88 v45.72,7.62
SCL
  Top 0.254: J1.3 40.55,3.9 41.27,3.17 48.26,3.17 50.16,5.08 55.24,5.08 55.88,4.45 65.41,4.45 66.04,5.08 72.39,5.08 73.36,4.11 U1.17
SDA  (via drill 0.46)
  Top 0.254: U1.18 76.56,3.46 v77.47,2.54
  Bottom 0.254: v77.47,2.54 76.2,1.27 53.98,1.27 52.07,3.17 39.37,3.17 38.55,4 J1.2
VPP/!MCLR  (via drill 0.46)
  Top 0.254: U1.4 79.72,4.11 v78.74,5.08 | v59.69,6.99 60.33,7.62 60.96,7.62 61.59,6.99 66.04,6.99 66.67,6.35 68.58,6.35 v69.22,6.99 | J1.7 49.18,5.71 52.07,5.71 53.34,6.99 v54.61,6.99
  Bottom 0.254: v78.74,5.08 71.12,5.08 v69.22,6.99 | v59.69,6.99 v54.61,6.99

### Text on the board
tPlace: PC-01
_tsilk: QA1 | QA2 | QA3 | QA4 | QA5 | R18 | QA6 | QA7 | QA8 | QA9 | QA10 | QA11 | QA12 | U3 | U2 | U4 | R17 | R21 | R25 | R29 | C5 | R16 | R19 | R33 | R11 | R13 | R32 | U5 | PC-01 | Q1 | U1 | U6
_bsilk: R8 | R6 | R5 | R3 | R27 | R7 | R1 | R10 | R12 | R20 | R24 | R28 | R15 | R23 | R26 | R2 | R30 | R31 | R14 | R34 | C1 | C6 | C2 | J1 | R4 | R9 | C3 | R22 | C4